# Altium project SmHPL.PrjPcb (part 2 of 2)

## Sheet Page 5_DDR.SchDoc: Smart home panel 558.211-7
size A3; Scale: 1:1; SheetNumber: 3; SheetTotal: 3
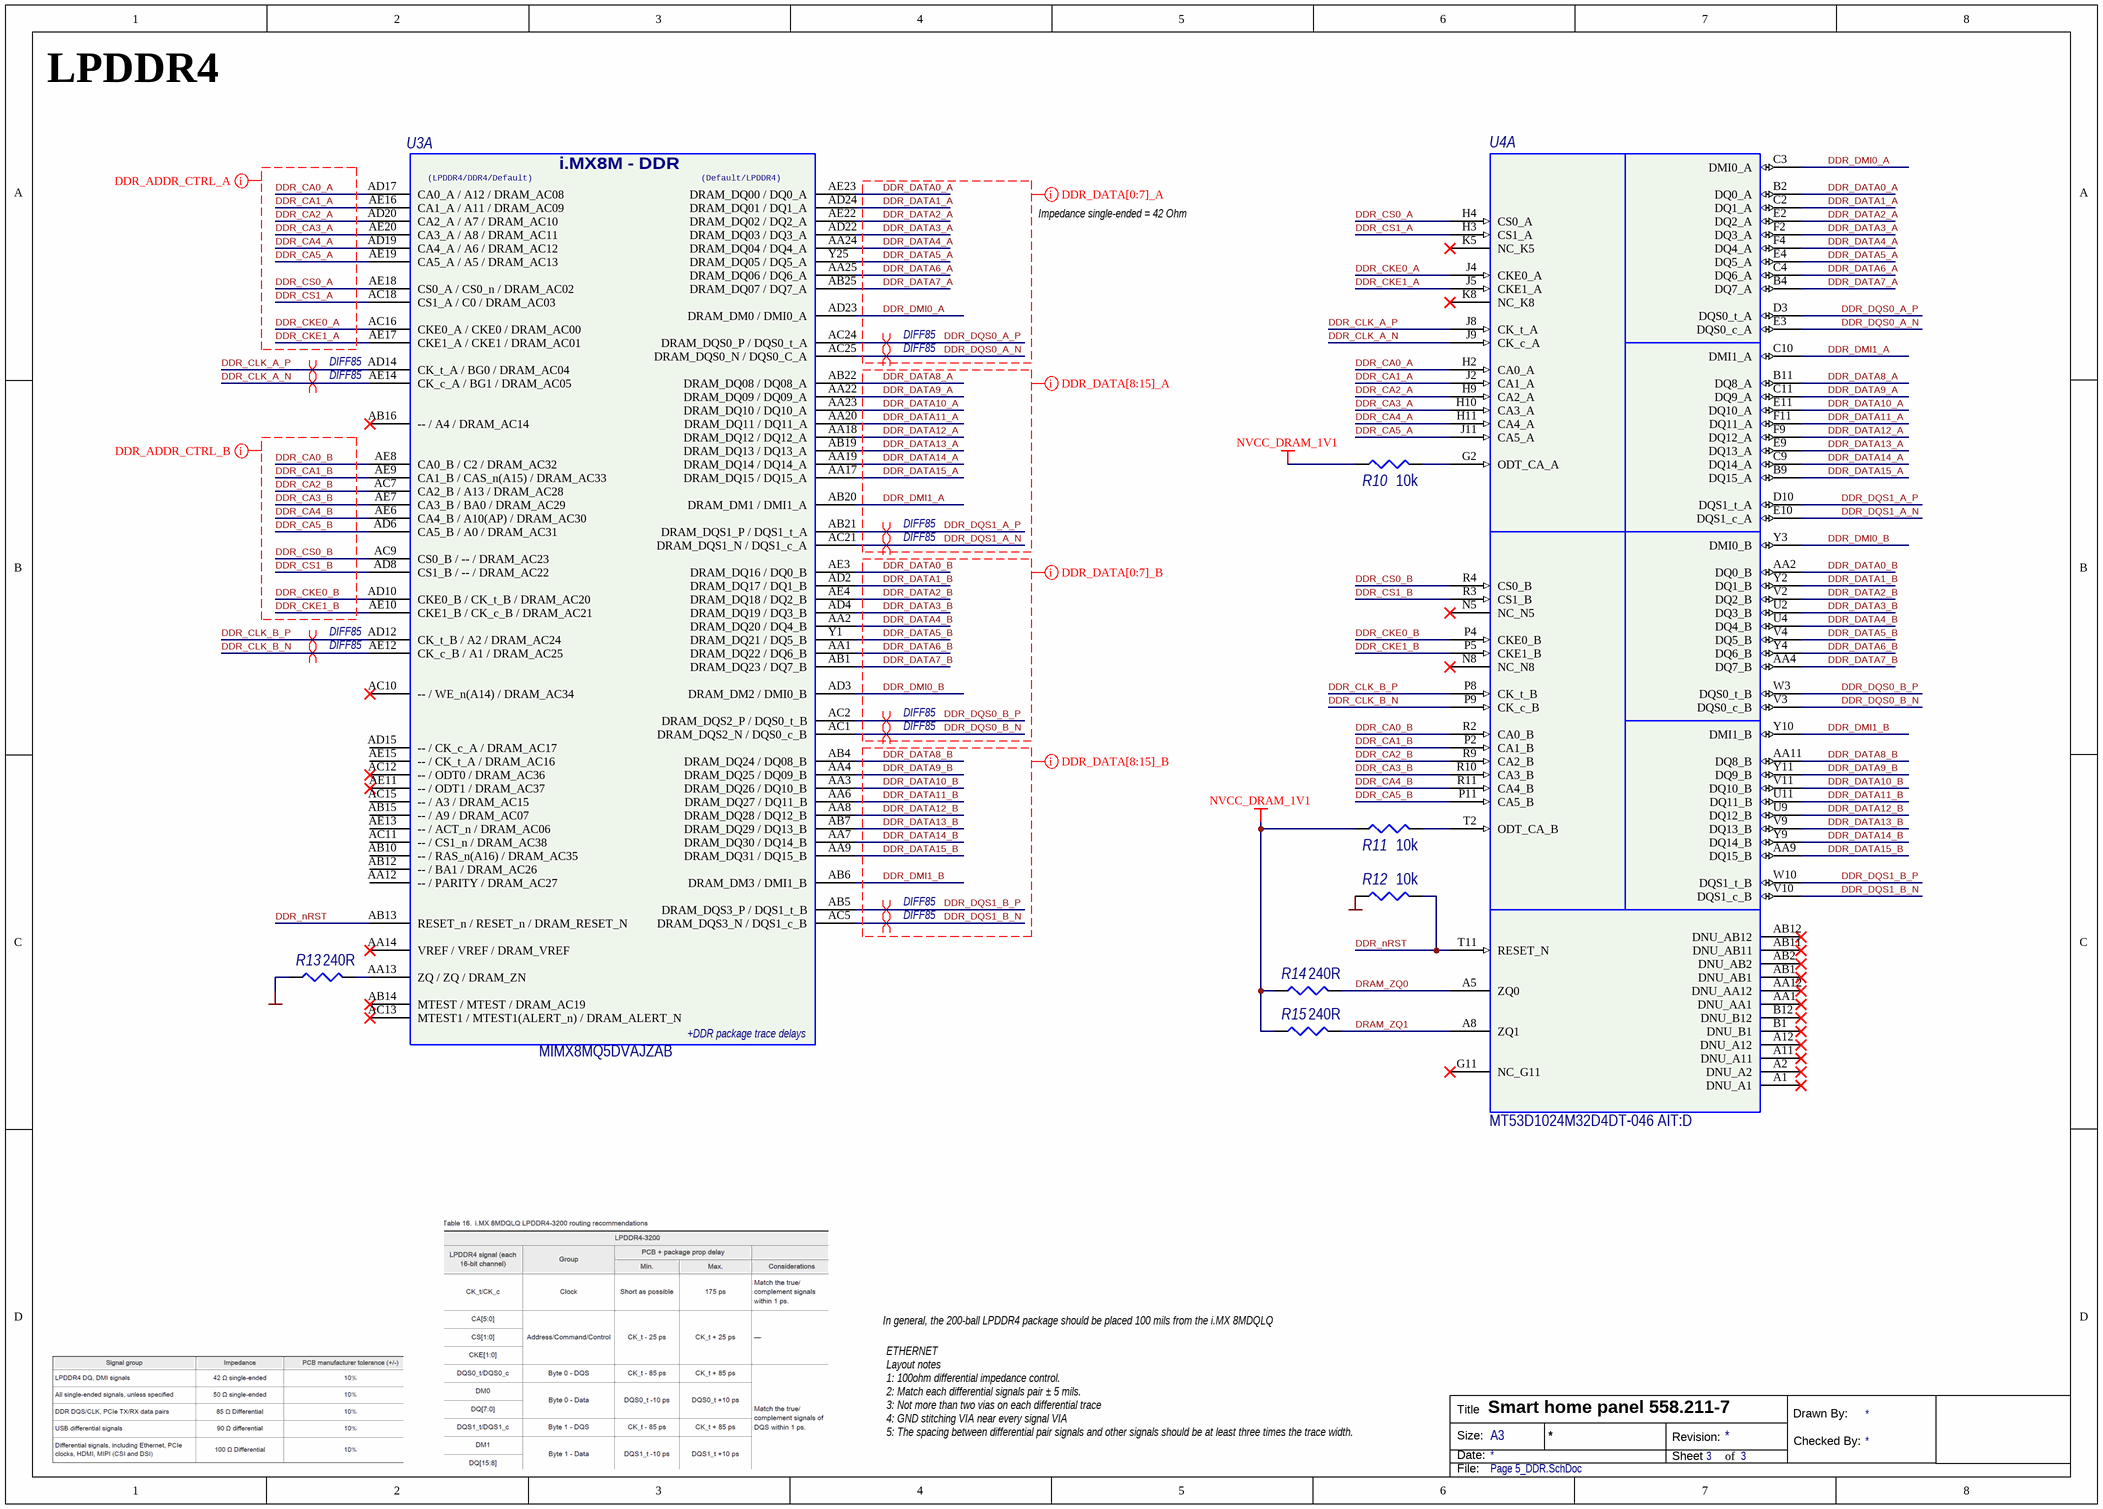
[diagram p8: Page 5_DDR.SchDoc]

### Parts
R10  10k  [R0402_L_R]
R11  10k  [R0402_L_R]
R12  10k  [R0402_L_R]
R13  240R  [R0402_L_R]
R14  240R  [R0402_L_R]
R15  240R  [R0402_L_R]
U3  MIMX8MQ5DVAJZAB  [FCPBGA-621_NXP]  (part A of 14)
U4  MT53D1024M32D4DT-046 AIT:D  [VFBGA200_10x14x0.95]  (part A of 2)

### Nets
0V: R12.1 R13.1
NVCC_DRAM_1V1: R10.1 R11.1 R14.1 R15.1
DDR_CA0_A: U3.AD17(CA0_A_/_A12_/_DRAM_AC08) U4.H2(CA0_A)
DDR_CA0_B: U3.AE8(CA0_B_/_C2_/_DRAM_AC32) U4.R2(CA0_B)
DDR_CA1_A: U3.AE16(CA1_A_/_A11_/_DRAM_AC09) U4.J2(CA1_A)
DDR_CA1_B: U3.AE9(CA1_B_/_CAS_n(A15)_/_DRAM_AC33) U4.P2(CA1_B)
DDR_CA2_A: U3.AD20(CA2_A_/_A7_/_DRAM_AC10) U4.H9(CA2_A)
DDR_CA2_B: U3.AC7(CA2_B_/_A13_/_DRAM_AC28) U4.R9(CA2_B)
DDR_CA3_A: U3.AE20(CA3_A_/_A8_/_DRAM_AC11) U4.H10(CA3_A)
DDR_CA3_B: U3.AE7(CA3_B_/_BA0_/_DRAM_AC29) U4.R10(CA3_B)
DDR_CA4_A: U3.AD19(CA4_A_/_A6_/_DRAM_AC12) U4.H11(CA4_A)
DDR_CA4_B: U3.AE6(CA4_B_/_A10(AP)_/_DRAM_AC30) U4.R11(CA4_B)
DDR_CA5_A: U3.AE19(CA5_A_/_A5_/_DRAM_AC13) U4.J11(CA5_A)
DDR_CA5_B: U3.AD6(CA5_B_/_A0_/_DRAM_AC31) U4.P11(CA5_B)
DDR_CKE0_A: U3.AC16(CKE0_A_/_CKE0_/_DRAM_AC00) U4.J4(CKE0_A)
DDR_CKE0_B: U3.AD10(CKE0_B_/_CK_t_B_/_DRAM_AC20) U4.P4(CKE0_B)
DDR_CKE1_A: U3.AE17(CKE1_A_/_CKE1_/_DRAM_AC01) U4.J5(CKE1_A)
DDR_CKE1_B: U3.AE10(CKE1_B_/_CK_c_B_/_DRAM_AC21) U4.P5(CKE1_B)
DDR_CLK_A_N: U3.AE14(CK_c_A_/_BG1_/_DRAM_AC05) U4.J9(CK_c_A)
DDR_CLK_A_P: U3.AD14(CK_t_A_/_BG0_/_DRAM_AC04) U4.J8(CK_t_A)
DDR_CLK_B_N: U3.AE12(CK_c_B_/_A1_/_DRAM_AC25) U4.P9(CK_c_B)
DDR_CLK_B_P: U3.AD12(CK_t_B_/_A2_/_DRAM_AC24) U4.P8(CK_t_B)
DDR_CS0_A: U3.AE18(CS0_A_/_CS0_n_/_DRAM_AC02) U4.H4(CS0_A)
DDR_CS0_B: U3.AC9(CS0_B_/_--_/_DRAM_AC23) U4.R4(CS0_B)
DDR_CS1_A: U3.AC18(CS1_A_/_C0_/_DRAM_AC03) U4.H3(CS1_A)
DDR_CS1_B: U3.AD8(CS1_B_/_--_/_DRAM_AC22) U4.R3(CS1_B)
DDR_DATA0_A: U3.AE23(DRAM_DQ00_/_DQ0_A) U4.B2(DQ0_A)
DDR_DATA0_B: U3.AE3(DRAM_DQ16_/_DQ0_B) U4.AA2(DQ0_B)
DDR_DATA1_A: U3.AD24(DRAM_DQ01_/_DQ1_A) U4.C2(DQ1_A)
DDR_DATA1_B: U3.AD2(DRAM_DQ17_/_DQ1_B) U4.Y2(DQ1_B)
DDR_DATA2_A: U3.AE22(DRAM_DQ02_/_DQ2_A) U4.E2(DQ2_A)
DDR_DATA2_B: U3.AE4(DRAM_DQ18_/_DQ2_B) U4.V2(DQ2_B)
DDR_DATA3_A: U3.AD22(DRAM_DQ03_/_DQ3_A) U4.F2(DQ3_A)
DDR_DATA3_B: U3.AD4(DRAM_DQ19_/_DQ3_B) U4.U2(DQ3_B)
DDR_DATA4_A: U3.AA24(DRAM_DQ04_/_DQ4_A) U4.F4(DQ4_A)
DDR_DATA4_B: U3.AA2(DRAM_DQ20_/_DQ4_B) U4.U4(DQ4_B)
DDR_DATA5_A: U3.Y25(DRAM_DQ05_/_DQ5_A) U4.E4(DQ5_A)
DDR_DATA5_B: U3.Y1(DRAM_DQ21_/_DQ5_B) U4.V4(DQ5_B)
DDR_DATA6_A: U3.AA25(DRAM_DQ06_/_DQ6_A) U4.C4(DQ6_A)
DDR_DATA6_B: U3.AA1(DRAM_DQ22_/_DQ6_B) U4.Y4(DQ6_B)
DDR_DATA7_A: U3.AB25(DRAM_DQ07_/_DQ7_A) U4.B4(DQ7_A)
DDR_DATA7_B: U3.AB1(DRAM_DQ23_/_DQ7_B) U4.AA4(DQ7_B)
DDR_DATA8_A: U3.AB22(DRAM_DQ08_/_DQ08_A) U4.B11(DQ8_A)
DDR_DATA8_B: U3.AB4(DRAM_DQ24_/_DQ08_B) U4.AA11(DQ8_B)
DDR_DATA9_A: U3.AA22(DRAM_DQ09_/_DQ09_A) U4.C11(DQ9_A)
DDR_DATA9_B: U3.AA4(DRAM_DQ25_/_DQ09_B) U4.Y11(DQ9_B)
DDR_DATA10_A: U3.AA23(DRAM_DQ10_/_DQ10_A) U4.E11(DQ10_A)
DDR_DATA10_B: U3.AA3(DRAM_DQ26_/_DQ10_B) U4.V11(DQ10_B)
DDR_DATA11_A: U3.AA20(DRAM_DQ11_/_DQ11_A) U4.F11(DQ11_A)
DDR_DATA11_B: U3.AA6(DRAM_DQ27_/_DQ11_B) U4.U11(DQ11_B)
DDR_DATA12_A: U3.AA18(DRAM_DQ12_/_DQ12_A) U4.F9(DQ12_A)
DDR_DATA12_B: U3.AA8(DRAM_DQ28_/_DQ12_B) U4.U9(DQ12_B)
DDR_DATA13_A: U3.AB19(DRAM_DQ13_/_DQ13_A) U4.E9(DQ13_A)
DDR_DATA13_B: U3.AB7(DRAM_DQ29_/_DQ13_B) U4.V9(DQ13_B)
DDR_DATA14_A: U3.AA19(DRAM_DQ14_/_DQ14_A) U4.C9(DQ14_A)
DDR_DATA14_B: U3.AA7(DRAM_DQ30_/_DQ14_B) U4.Y9(DQ14_B)
DDR_DATA15_A: U3.AA17(DRAM_DQ15_/_DQ15_A) U4.B9(DQ15_A)
DDR_DATA15_B: U3.AA9(DRAM_DQ31_/_DQ15_B) U4.AA9(DQ15_B)
DDR_DMI0_A: U3.AD23(DRAM_DM0_/_DMI0_A) U4.C3(DMI0_A)
DDR_DMI0_B: U3.AD3(DRAM_DM2_/_DMI0_B) U4.Y3(DMI0_B)
DDR_DMI1_A: U3.AB20(DRAM_DM1_/_DMI1_A) U4.C10(DMI1_A)
DDR_DMI1_B: U3.AB6(DRAM_DM3_/_DMI1_B) U4.Y10(DMI1_B)
DDR_DQS0_A_N: U3.AC25(DRAM_DQS0_N_/_DQS0_C_A) U4.E3(DQS0_c_A)
DDR_DQS0_A_P: U3.AC24(DRAM_DQS0_P_/_DQS0_t_A) U4.D3(DQS0_t_A)
DDR_DQS0_B_N: U3.AC1(DRAM_DQS2_N_/_DQS0_c_B) U4.V3(DQS0_c_B)
DDR_DQS0_B_P: U3.AC2(DRAM_DQS2_P_/_DQS0_t_B) U4.W3(DQS0_t_B)
DDR_DQS1_A_N: U3.AC21(DRAM_DQS1_N_/_DQS1_c_A) U4.E10(DQS1_c_A)
DDR_DQS1_A_P: U3.AB21(DRAM_DQS1_P_/_DQS1_t_A) U4.D10(DQS1_t_A)
DDR_DQS1_B_N: U3.AC5(DRAM_DQS3_N_/_DQS1_c_B) U4.V10(DQS1_c_B)
DDR_DQS1_B_P: U3.AB5(DRAM_DQS3_P_/_DQS1_t_B) U4.W10(DQS1_t_B)
DDR_nRST: R12.2 U3.AB13(RESET_n_/_RESET_n_/_DRAM_RESET_N) U4.T11(RESET_N)
DRAM_ZQ0: R14.2 U4.A5(ZQ0)
DRAM_ZQ1: R15.2 U4.A8(ZQ1)
NetR10_2: R10.2 U4.G2(ODT_CA_A)
NetR11_2: R11.2 U4.T2(ODT_CA_B)
NetR13_2: R13.2 U3.AA13(ZQ_/_ZQ_/_DRAM_ZN)

Not connected (* = marked no-connect by the designer): U3 AA12(--_/_PARITY_/_DRAM_AC27) AA14(VREF_/_VREF_/_DRAM_VREF)* AB10(--_/_RAS_n(A16)_/_DRAM_AC35) AB12(--_/_BA1_/_DRAM_AC26) AB14(MTEST_/_MTEST_/_DRAM_AC19)* AB15(--_/_A9_/_DRAM_AC07) AB16(--_/_A4_/_DRAM_AC14)* AC10(--_/_WE_n(A14)_/_DRAM_AC34)* AC11(--_/_CS1_n_/_DRAM_AC38) AC12(--_/_ODT0_/_DRAM_AC36)* AC13(MTEST1_/_MTEST1(ALERT_n)_/_DRAM_ALERT_N)* AC15(--_/_A3_/_DRAM_AC15) AD15(--_/_CK_c_A_/_DRAM_AC17) AE11(--_/_ODT1_/_DRAM_AC37)* AE13(--_/_ACT_n_/_DRAM_AC06) AE15(--_/_CK_t_A_/_DRAM_AC16); U4 A1(DNU_A1)* A2(DNU_A2)* A11(DNU_A11)* A12(DNU_A12)* AA1(DNU_AA1)* AA12(DNU_AA12)* AB1(DNU_AB1)* AB2(DNU_AB2)* AB11(DNU_AB11)* AB12(DNU_AB12)* B1(DNU_B1)* B12(DNU_B12)* G11(NC_G11)* K5(NC_K5)* K8(NC_K8)* N5(NC_N5)* N8(NC_N8)*

### Layout directives
net class DDR_DATA[8:15]_B; rule Matched Net Lengths [Delay Tolerance = 1ps]; rule Impedance Constraint [Min = 41.80    Max = 42.20    ]; rule Matched Net Lengths [Delay Tolerance = 10ps]: DDR_DATA8_B, DDR_DATA9_B, DDR_DATA10_B, DDR_DATA11_B, DDR_DATA12_B, DDR_DATA13_B, DDR_DATA14_B, DDR_DATA15_B, DDR_DMI1_B, DDR_DQS1_B_N, DDR_DQS1_B_P
differential pair; differential pair class DIFF85: DDR_CLK_A_N, DDR_CLK_A_P, DDR_CLK_B_N, DDR_CLK_B_P, DDR_DQS0_A_N, DDR_DQS0_A_P, DDR_DQS0_B_N, DDR_DQS0_B_P, DDR_DQS1_A_N, DDR_DQS1_A_P, DDR_DQS1_B_N, DDR_DQS1_B_P
net class DDR_DATA[0:7]_A; rule Matched Net Lengths [Delay Tolerance = 1ps]; rule Impedance Constraint [Min = 41.80    Max = 42.20    ]; rule Matched Net Lengths [Delay Tolerance = 10ps]: DDR_DATA0_A, DDR_DATA1_A, DDR_DATA2_A, DDR_DATA3_A, DDR_DATA4_A, DDR_DATA5_A, DDR_DATA6_A, DDR_DATA7_A, DDR_DMI0_A, DDR_DQS0_A_N, DDR_DQS0_A_P
net class DDR_DATA[8:15]_A; rule Matched Net Lengths [Delay Tolerance = 1ps]; rule Impedance Constraint [Min = 41.80    Max = 42.20    ]; rule Matched Net Lengths [Delay Tolerance = 10ps]: DDR_DATA8_A, DDR_DATA9_A, DDR_DATA10_A, DDR_DATA11_A, DDR_DATA12_A, DDR_DATA13_A, DDR_DATA14_A, DDR_DATA15_A, DDR_DMI1_A, DDR_DQS1_A_N, DDR_DQS1_A_P
net class DDR_DATA[0:7]_B; rule Matched Net Lengths [Delay Tolerance = 1ps]; rule Impedance Constraint [Min = 41.80    Max = 42.20    ]; rule Matched Net Lengths [Delay Tolerance = 10ps]: DDR_DATA0_B, DDR_DATA1_B, DDR_DATA2_B, DDR_DATA3_B, DDR_DATA4_B, DDR_DATA5_B, DDR_DATA6_B, DDR_DATA7_B, DDR_DMI0_B, DDR_DQS0_B_N, DDR_DQS0_B_P
net class DDR_ADDR_CTRL_A; rule Impedance Constraint [Min = 48.80    Max = 50.20    ]; rule Matched Net Lengths [Delay Tolerance = 10ps]: DDR_CA0_A, DDR_CA1_A, DDR_CA2_A, DDR_CA3_A, DDR_CA4_A, DDR_CA5_A, DDR_CKE0_A, DDR_CKE1_A, DDR_CS0_A, DDR_CS1_A
net class DDR_ADDR_CTRL_B; rule Impedance Constraint [Min = 48.80    Max = 50.20    ]; rule Matched Net Lengths [Delay Tolerance = 10ps]: DDR_CA0_B, DDR_CA1_B, DDR_CA2_B, DDR_CA3_B, DDR_CA4_B, DDR_CA5_B, DDR_CKE0_B, DDR_CKE1_B, DDR_CS0_B, DDR_CS1_B

### Notes on the sheet
- LPDDR4
- Impedance single-ended = 42 Ohm
- In general, the 200-ball LPDDR4 package should be placed 100 mils from the i.MX 8MDQLQ
- ETHERNET 1
- Layout notes
  1: 100ohm differential impedance control.
  2: Match each differential signals pair ± 5 mils.
  3: Not more than two vias on each differential trace
  4: GND stitching VIA near every signal VIA
  5: The spacing between differential pair signals and other signals should be at least three times the trace width.
- Title
- Size:
- Date:
- A3
- Revision:
- Sheet
- of
- Drawn By:
- Checked By:
- File:
- (in symbol I.MX8MQ5DVAJZAB, part A) i.MX8M - DDR; (LPDDR4/DDR4/Default); (Default/LPDDR4); +DDR package trace delays

### Library data of the parts
R10-R12 = RC0402FR-0710KL: RES 10.0K OHM 1/16W 1% 0402; Manufacturer: Yageo; Power (Watts): 0.063W, 1/16W; .Checked PCB: used; Temperature Coefficient: ±100ppm/°C; Category: Resistors; Supplier Part Number: 311-10.0KLRCT-ND; Manufacturer Part Number: RC0402FR-0710KL; Package / Case: 0402 (1005 Metric); Price 1k [$]: 0.01421; Resistance (Ohms): 10K; Tolerance: ±1%; Value: 10k; .Checked SCH: used; Supplier: Digikey; Supplier 1: Digi-Key; Supplier Part Number 1: 311-10.0KLRCT-ND; RoHS: RoHS Compliant; Stock 1: 2916495; Pricing 1: 10=0.014, 50=0.0104, 100=0.0079, 250=0.00584, 500=0.00432, 1000=0.00288 (USD); Composition: Thick Film; Features: -; Size / Dimension: 0.039" L x 0.020" W (1.00mm x 0.50mm); Height: 0.016" (0.40mm); Number of Terminations: 2; Packaging: Cut Tape (CT); ComponentLink1URL: http://www.yageo.com/documents/recent/PYu-RC0402_51_RoHS_L_6.pdf; ComponentLink1Description: http://www.yageo.com/documents/recent/PYu-RC0402_51_RoHS_L_6.pdf
R13-R15 = RC0402FR-07240RL: RES 240 OHM 1/16W 1% 0402 ±100ppm; Manufacturer: Yageo; Power Rating: 63mW; Temperature Coefficient: 100ppm/°C; Voltage Rating (DC): 50V; ComponentLink1URL: http://www.yageo.com/documents/recent/PYu-RC0402_51_RoHS_L_6.pdf; ComponentLink1Description: http://www.yageo.com/documents/recent/PYu-RC0402_51_RoHS_L_6.pdf; ComponentLink2URL: https://datasheet.ciiva.com/7849/1018594-7849915.pdf?src-supplier=Element14; ComponentLink2Description: https://datasheet.ciiva.com/7849/1018594-7849915.pdf?src-supplier=Element14; ComponentLink3URL: https://datasheet.ciiva.com/7849/1018594-7849916.pdf?src-supplier=Element14; ComponentLink3Description: https://datasheet.ciiva.com/7849/1018594-7849916.pdf?src-supplier=Element14; ComponentLink4URL: https://datasheet.ciiva.com/2519/pyu-r-int-thick-7-2519157.pdf?src-supplier=Digi-Key; ComponentLink4Description: https://datasheet.ciiva.com/2519/pyu-r-int-thick-7-2519157.pdf?src-supplier=Digi-Key; ComponentLink5URL: https://datasheet.ciiva.com/2519/pyu-r-int-thick-7-2519158.pdf?src-supplier=Digi-Key; ComponentLink5Description: https://datasheet.ciiva.com/2519/pyu-r-int-thick-7-2519158.pdf?src-supplier=Digi-Key; ComponentLink6URL: https://datasheet.ciiva.com/2519/pyu-r-int-thick-7-2519156.pdf?src-supplier=Digi-Key; ComponentLink6Description: https://datasheet.ciiva.com/2519/pyu-r-int-thick-7-2519156.pdf?src-supplier=Digi-Key; ComponentLink7URL: https://datasheet.ciiva.com/12669/pyu-rc0402-51-rohs-l-6-r-12669689.pdf?src-supplier=Mouser; ComponentLink7Description: https://datasheet.ciiva.com/12669/pyu-rc0402-51-rohs-l-6-r-12669689.pdf?src-supplier=Mouser; ComponentLink8URL: https://datasheet.ciiva.com/17419/pyu-rc0402-51-rohs-l-6-r-17419482.pdf?src-supplier=Future+Electronics; ComponentLink8Description: https://datasheet.ciiva.com/17419/pyu-rc0402-51-rohs-l-6-r-17419482.pdf?src-supplier=Future+Electronics; Supplier 1: Digi-Key; Manufacturer Part Number: RC0402FR-07240RL; Category: Chip SMD Resistors; Stock 1: 4733632; Pricing 1: 1=0.10000, 10=0.01400, 100=0.00580, 1000=0.00262, 2500=0.00228, 5000=0.00188 (USD); Case/Package: 0402; Case Code (Metric): 1005; Case Code (Imperial): 0402; Min Operating Temperature: -55°C; Max Operating Temperature: 155°C; Value: 240R; Tolerance: 1%; Packaging: Tape and Reel; Resistor Type: Thick Film; Voltage Rating: 50V; Package Quantity: 1; Number of Terminations: 2; Termination: SMD/SMT; Max Power Dissipation: 63mW; Features: Moisture Resistant; Series: RC; Construction: Rectangular; Resistance Tolerance: 1%; Length: 1mm; Width: 0.02inch; Height: 0.016inch; Depth: 0.5mm; Lead Free: Lead Free; RoHS Compliant: Yes; Military Standard: Not; Supplier Part Number 1: 311-240LRCT-ND
U3 = I.MX8MQ5DVAJZAB: ARM Cortex-A53 Microprocessor IC i.MX8MQ 4 Core, 64-Bit 1.5GHz 621-FCPBGA (17x17); Manufacturer: NXP Semiconductors; Supplier 1: Digi-Key; Manufacturer Part Number: MIMX8MQ5DVAJZAB; Category: Microprocessors; Stock 1: 760; Pricing 1: 1=71.97000, 10=58.78600, 90=53.09733 (USD); Supplier Part Number 1: 568-14719-ND
U4 = MT53D1024M32D4DT: DRAM Chip LPDDR4 SDRAM 32Gbit 1024M X 32 200-Ball VFBGA; Manufacturer: Micron Technology; Memory Format: Volatile; Memory Size: 32Gb; Frequency: 2.133GHz; Supplier 1: Mouser; Manufacturer Part Number: MT53D1024M32D4DT-046 AIT:D; Category: Memory; Min Operating Temperature: -40°C; Max Operating Temperature: 95°C; Supplier Part Number 1: 340-343901-TRAY

## Nets that join several sheets
0V: Page 3_PMIC (48 pins), Page 4_Power CPU_DDR (356 pins), Page 5_DDR (R12.1 R13.1)
CD_Card_PWR: Page 3_PMIC (C?#36.1 TP?#14.1 U?#2.66 U?#2.67), Page 4_Power CPU_DDR (C27.1 U1.N23)
NVCC_3V3: Page 3_PMIC (7 pins), Page 4_Power CPU_DDR (22 pins)
NVCC_DRAM_1V1: Page 3_PMIC (5 pins), Page 4_Power CPU_DDR (95 pins), Page 5_DDR (R10.1 R11.1 R14.1 R15.1)
NVCC_SNVS_3V3: Page 3_PMIC (C?#4.2 TP?#2.1 U?#2.19), Page 4_Power CPU_DDR (C6.1 U1.W18)
VDD_ARM_0V9: Page 3_PMIC (5 pins), Page 4_Power CPU_DDR (26 pins)
VDD_DRAM_0V9: Page 3_PMIC (5 pins), Page 4_Power CPU_DDR (38 pins)
VDD_GPU_0V9: Page 3_PMIC (5 pins), Page 4_Power CPU_DDR (18 pins)
VDD_PHY_0V9: Page 3_PMIC (C?#21.2 TP?#8.1 U?#2.53), Page 4_Power CPU_DDR (32 pins)
VDD_PHY_1V8: Page 3_PMIC (C?#31.2 TP?#12.1 U?#2.68), Page 4_Power CPU_DDR (12 pins)
VDD_PHY_3V3: Page 3_PMIC (C?#11.2 TP?#5.1 U?#2.14), Page 4_Power CPU_DDR (7 pins)
VDD_SNVS_0V9: Page 3_PMIC (C?#6.2 TP?#3.1 U?#2.18), Page 4_Power CPU_DDR (C5.1 U1.R18)
VDD_SOC_0V9: Page 3_PMIC (5 pins), Page 4_Power CPU_DDR (35 pins)
VDD_VPU_0V9: Page 3_PMIC (5 pins), Page 4_Power CPU_DDR (15 pins)
VDDA_DRAM_1V8: Page 3_PMIC (C?#26.2 TP?#10.1 U?#2.1 U?#2.3), Page 4_Power CPU_DDR (18 pins)